# EAGLE design current_sense (EAGLE 6.5.0)
AUTHOR: Brad Campbell; REV: v3; TITLE: Current Sense
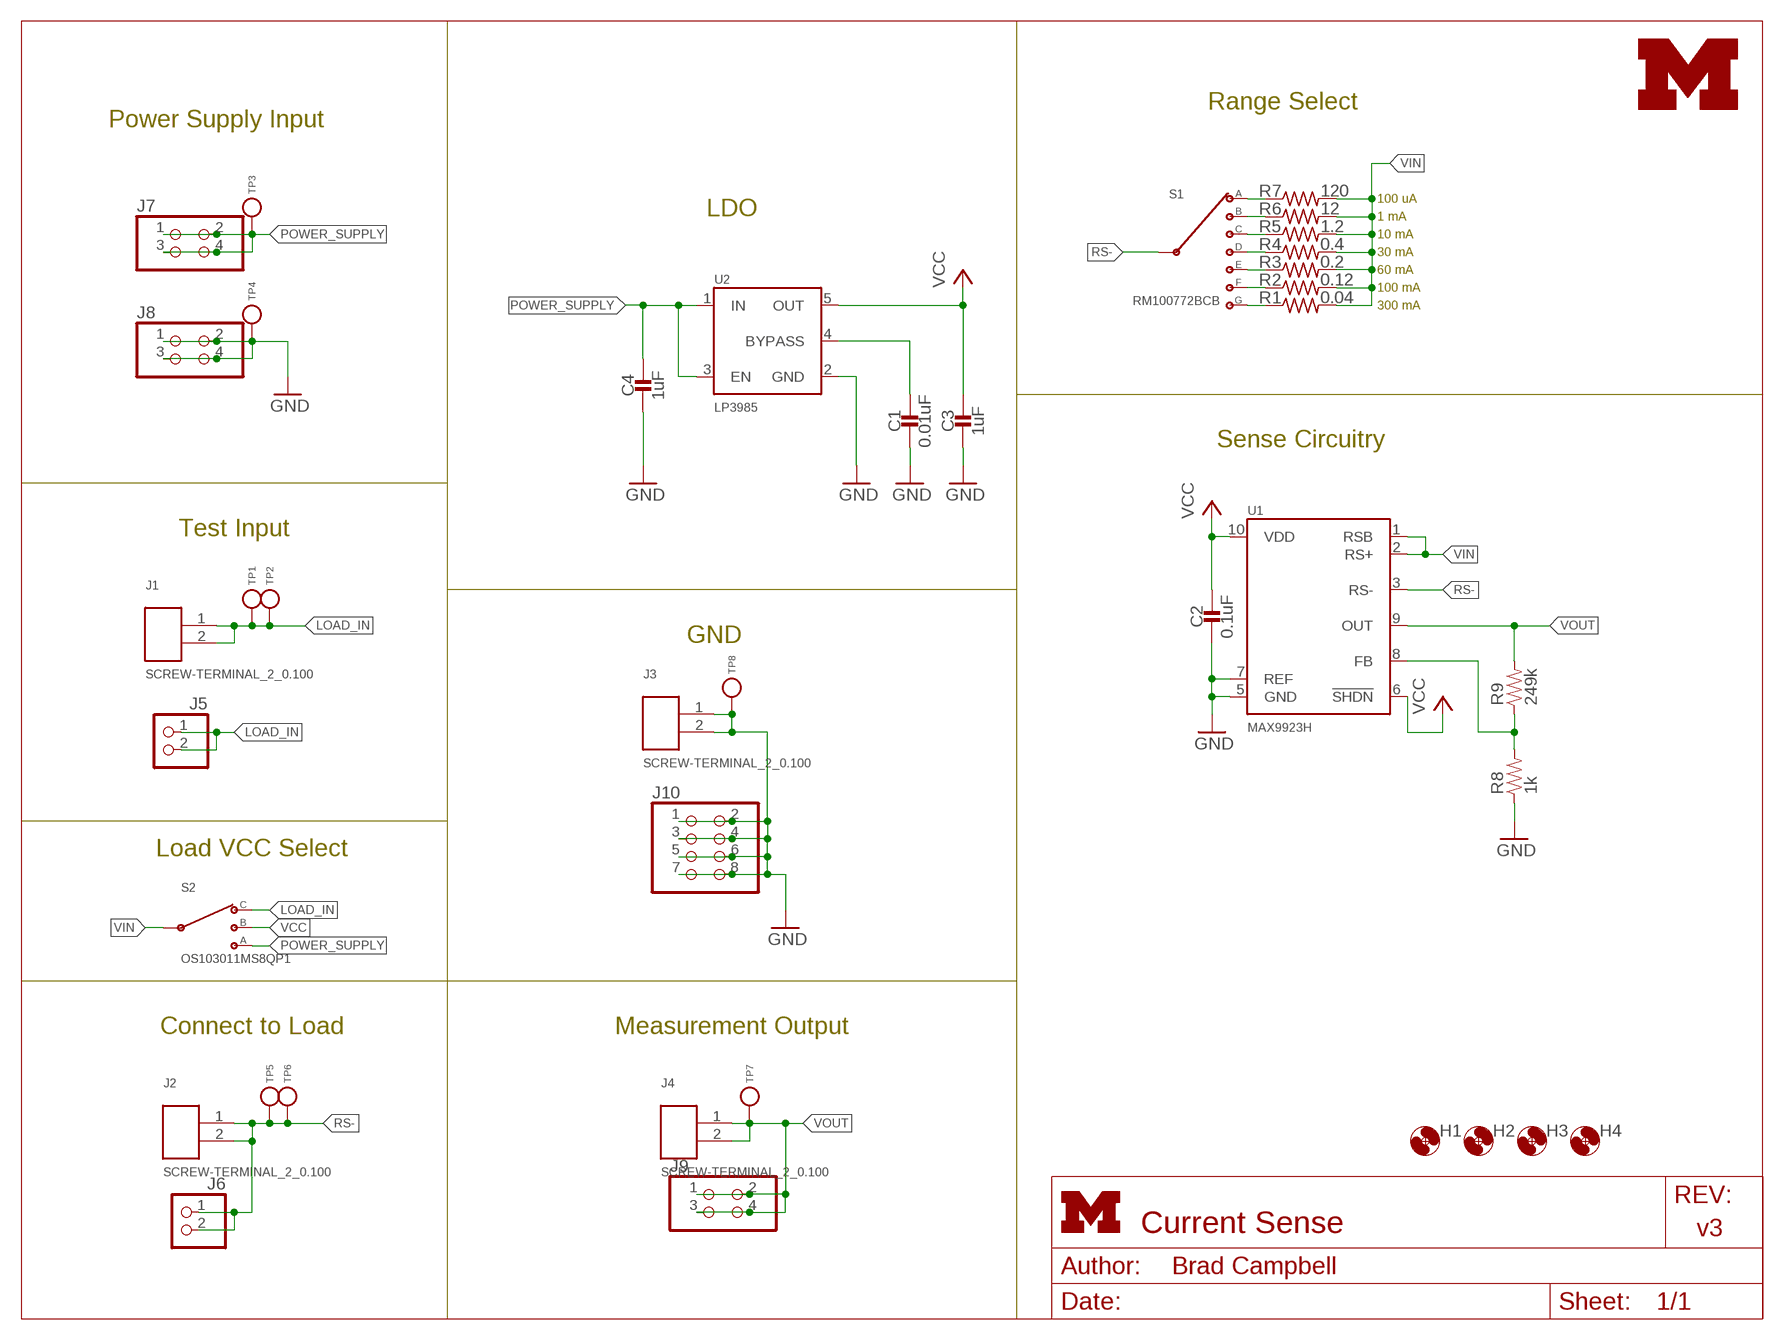
[diagram p0: schematic, sheet 1]
FRAME1 (LETTER_L_UMICH): HEIGHT: 8.5in; WIDTH: 11in

## Parts
C1  0.01uF  CAPACITOR0603_CAP  [0603_CAP]
C2  0.1uF  CAPACITOR0603_CAP  [0603_CAP]
C3  1uF  CAPACITOR0603_CAP  [0603_CAP]
C4  1uF  CAPACITOR0603_CAP  [0603_CAP]
H1  MOUNT-HOLE3.2  [3,2]
H2  MOUNT-HOLE3.2  [3,2]
H3  MOUNT-HOLE3.2  [3,2]
H4  MOUNT-HOLE3.2  [3,2]
J1  SCREW-TERMINAL_2_0.100  [CONN_BLOCK_2]
J2  SCREW-TERMINAL_2_0.100  [CONN_BLOCK_2]
J3  SCREW-TERMINAL_2_0.100  [CONN_BLOCK_2]
J4  SCREW-TERMINAL_2_0.100  [CONN_BLOCK_2]
J5  PINHD-1X2  [1X02]
J6  PINHD-1X2  [1X02]
J7  PINHD-2X2  [2X02]
J8  PINHD-2X2  [2X02]
J9  PINHD-2X2  [2X02]
J10  PINHD-2X4  [2X04]
LOGO2  UMICH_SOLID_MEDIUM  [UMICH_SOLID_200MIL]
R1  0.04  R-US_R1206  [R1206]
R2  0.12  R-US_R1206  [R1206]
R3  0.2  R-US_R1206  [R1206]
R4  0.4  R-US_R1206  [R1206]
R5  1.2  R-US_R0805  [R0805]
R6  12  R-US_R0805  [R0805]
R7  120  R-US_R0805  [R0805]
R8  1k  RESISTOR0603_RES  [0603-RES]
R9  249k  RESISTOR0603_RES  [0603-RES]
S1  RM100772BCB  [RM-SWITCH]
S2  OS103011MS8QP1  [OS102011MS8QP1]
TP1  TEST_POINT_0.040IN  [TESTPOINT_0.040IN]
TP2  TEST_POINT_0.040IN  [TESTPOINT_0.040IN]
TP3  TEST_POINT_0.040IN  [TESTPOINT_0.040IN]
TP4  TEST_POINT_0.040IN  [TESTPOINT_0.040IN]
TP5  TEST_POINT_0.040IN  [TESTPOINT_0.040IN]
TP6  TEST_POINT_0.040IN  [TESTPOINT_0.040IN]
TP7  TEST_POINT_0.040IN  [TESTPOINT_0.040IN]
TP8  TEST_POINT_0.112IN  [TESTPOINT_0.112IN]
U1  MAX9923H  [UMAX10]
U2  LP3985  [R-PDSO-G5]

## Nets
GND: C1.2 C2.2 C3.2 C4.2 J3.1 J3.2 J8.1 J8.2 J8.3 J8.4 J10.1 J10.2 J10.3 J10.4 J10.5 J10.6 J10.7 J10.8 R8.1 TP4.TESTPOINT TP8.1(TESTPOINT) U1.5(GND) U1.7(REF) U2.2(GND)
LOAD_IN: J1.1 J1.2 J5.1 J5.2 S2.4 TP1.TESTPOINT TP2.TESTPOINT
N$1: R7.1 S1.1(A)
N$2: R6.1 S1.2(B)
N$3: R5.1 S1.3(C)
N$4: R4.1 S1.4(D)
N$5: R3.1 S1.5(E)
N$6: R2.1 S1.6(F)
N$7: R8.2 R9.1 U1.8(FB)
N$8: C1.1 U2.4(BYPASS)
N$9: R1.1 S1.7(G)
POWER_SUPPLY: C4.1 J7.1 J7.2 J7.3 J7.4 S2.1 TP3.TESTPOINT U2.1(IN) U2.3(EN)
RS-: J2.1 J2.2 J6.1 J6.2 S1.C(INPUT) TP5.TESTPOINT TP6.TESTPOINT U1.3(RS-)
VCC: C2.1 C3.1 S2.3 U1.6(!SHDN) U1.10(VDD) U2.5(OUT)
VIN: R1.2 R2.2 R3.2 R4.2 R5.2 R6.2 R7.2 S2.2(C) U1.1(RSB) U1.2(RS+)
VOUT: J4.1 J4.2 J9.1 J9.2 J9.3 J9.4 R9.2 TP7.TESTPOINT U1.9(OUT)

## Notes on the sheet
- Range Select
- Power Supply Input
- 100 uA
- LDO | 1 mA
- 10 mA
- 30 mA
- 60 mA
- 100 mA
- 300 mA
- Sense Circuitry
- Test Input
- GND
- Load VCC Select
- Connect to Load | Measurement Output

## Library data of the parts
C1 = passives:CAPACITOR: 0402 Capacitor; DIGIKEY: 445-5100-1-ND
C2 = passives:CAPACITOR: 0402 Capacitor; DIGIKEY: 445-1316-1-ND
C3 C4 = passives:CAPACITOR: 0402 Capacitor; DIGIKEY: 445-1604-1-ND
H1-H4 = holes:MOUNT-HOLE: MOUNTING HOLE with drill center marker
J1-J4 = headers:SCREW-TERMINAL_2_0.100: 2x 0.100 in screw terminal block; DIGIKEY: 277-1273-ND; MOUSER: 651-1725656; NEWARK: 71C4107
J5 J6 = pinhead:PINHD-1X2: PIN HEADER
J7-J9 = pinhead:PINHD-2X2: PIN HEADER
J10 = pinhead:PINHD-2X4: PIN HEADER
LOGO2 = logos:UMICH_SOLID
R1 = resistor:R-US_: RESISTOR, American symbol; DIGIKEY: 311-.04LWCT-ND
R2 = resistor:R-US_: RESISTOR, American symbol; DIGIKEY: RL16R.12FCT-ND
R3 = resistor:R-US_: RESISTOR, American symbol; DIGIKEY: CSR1206FKR200CT-ND
R4 = resistor:R-US_: RESISTOR, American symbol; DIGIKEY: 311-.4LWCT-ND
R5 = resistor:R-US_: RESISTOR, American symbol; DIGIKEY: RL12S1.2FCT-ND
R6 = resistor:R-US_: RESISTOR, American symbol; DIGIKEY: A103150CT-ND
R7 = resistor:R-US_: RESISTOR, American symbol; DIGIKEY: RG20N120WCT-ND
R8 = passives:RESISTOR: Resistor Basic schematic elements and footprints for 0603, 1206, and PTH resistors.; DIGIKEY: P1.0KDBCT-ND
R9 = passives:RESISTOR: Resistor Basic schematic elements and footprints for 0603, 1206, and PTH resistors.; DIGIKEY: P249KDBCT-ND
S1 = switches:RM100772BCB: Rotary Switch 8 Position SP7T 500mA (DC) 24VDC Through Hole; DIGIKEY: CKN10705-ND
S2 = switches:OS103011MS8QP1: Slide Switch SP3T Through Hole; DIGIKEY: CKN9543-ND
TP1-TP7 = headers:TEST_POINT_0.040IN: 0.040in Test Point; DIGIKEY: 5001K-ND
TP8 = headers:TEST_POINT_0.112IN: Solder terminal, turreted; NEWARK: 40F6015
U1 = chips:MAX992: The MAX9922/MAX9923 ultra-precision, high-side current- sense amplifiers feature ultra-low offset voltage (VOS) of 25μV (max) and laser-trimmed gain accuracy better than 0.5%. The combination of low VOS and highgain accuracy allows precise current measurements even at very small sense voltages.; DIGIKEY: MAX9922EUB+TCT-ND
U2 = chips:LP3985: Linear Voltage Regulator IC Positive Fixed 1 Output 3.3V 150mA SOT-23-5; DIGIKEY: LP3985IM5-3.3/NOPBCT-ND

## Board
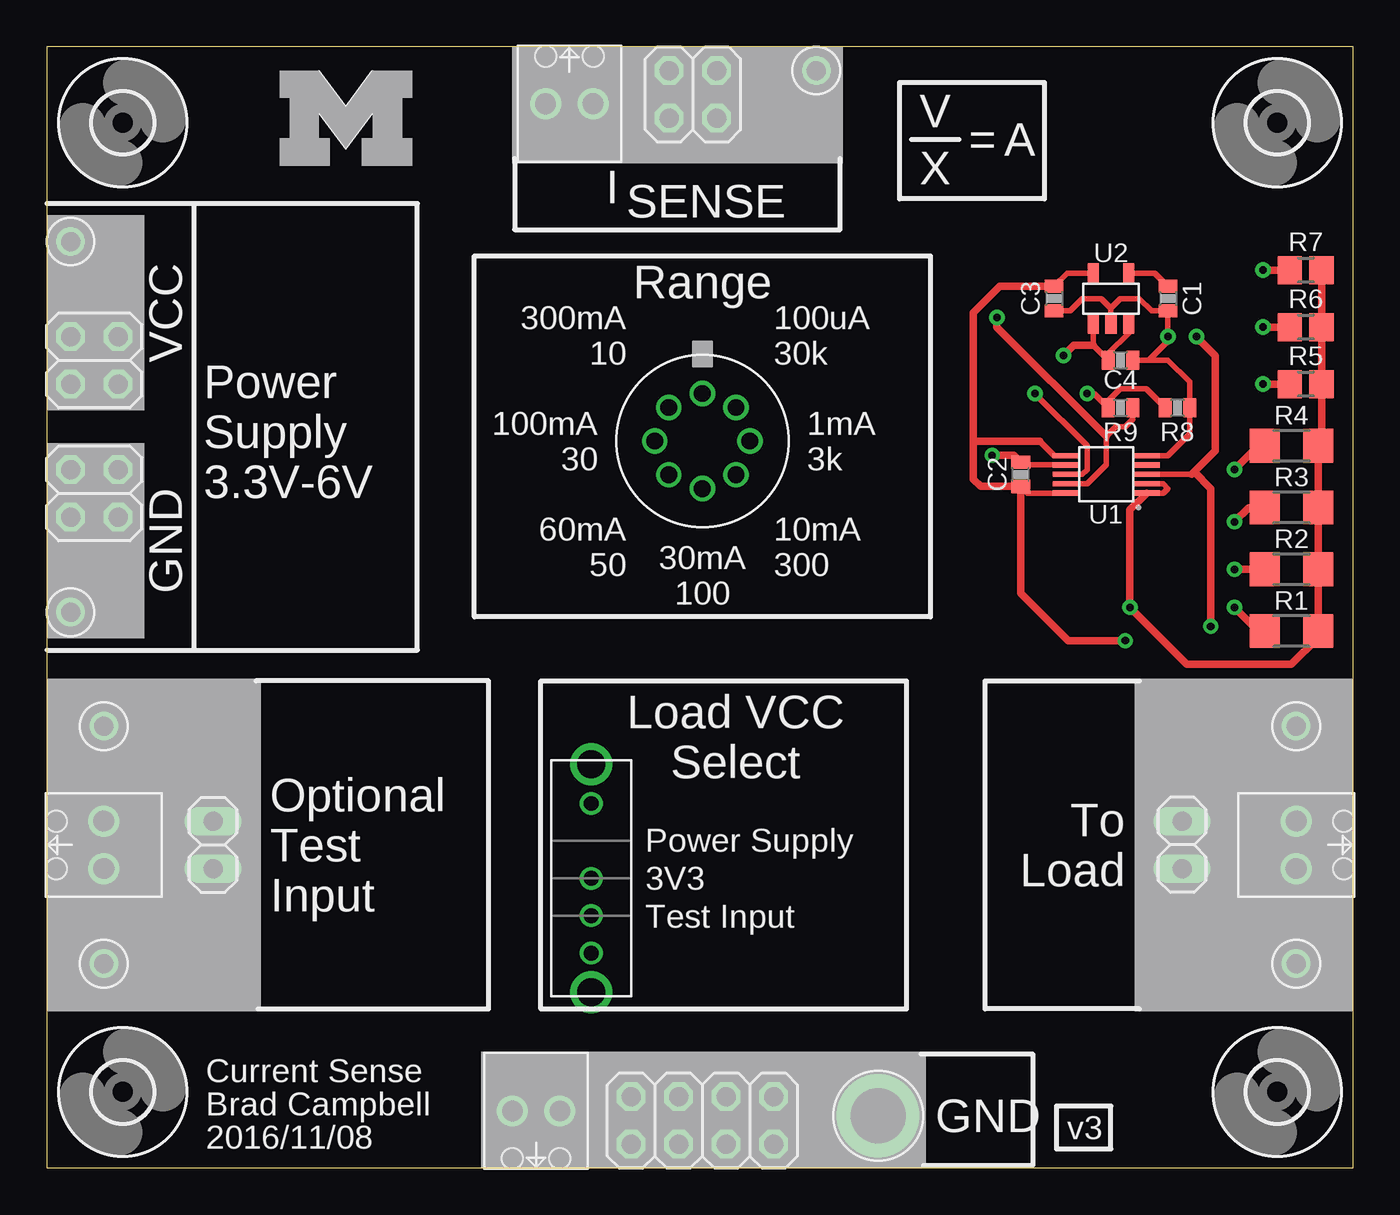
[diagram p1: board, top side]
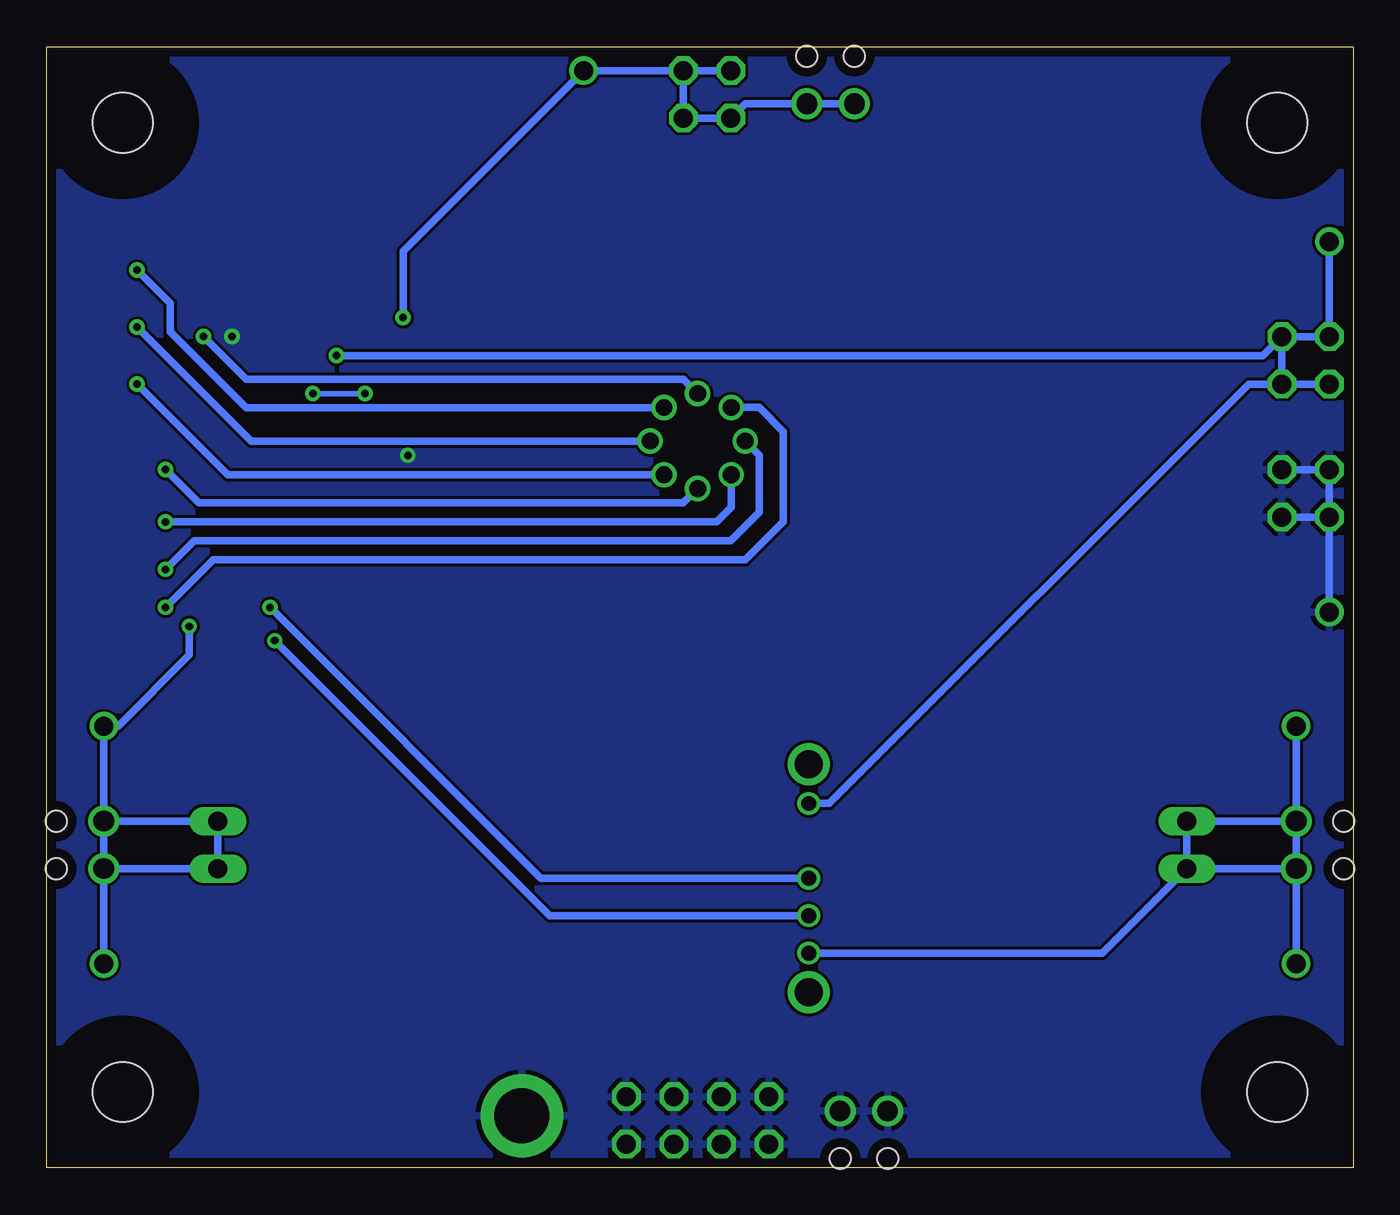
[diagram p2: board, bottom side, seen from below]

Size 69.85 x 59.94 mm. Coordinates in mm from the lower left corner, seen from the top.
Outline: 0,0 69.85,0 69.85,59.94 0,59.94 0,0
Copper layers (1*16): Top 0.0178mm / dielectric 59mil / Bottom 0.0178mm
Design rules "sunstone-2lyr_v1.0.0.3": minimum track width 6mil, minimum drill 14mil, track to track 6mil, track to pad 6mil, pad to pad 6mil, via to via 6mil, smd to smd 6mil, copper to edge 20mil, drill to drill 16mil, minimum pad ring 8mil, minimum via ring 8mil, stop-mask expansion 3mil, vias tented up to drill 50mil, thermal gap 10mil

### Footprints (pad centres in the part's own frame; a part is rotated, then mirrored left to right if it is on the bottom)
0603_CAP = smd 0.7 x 1: 1 -0.65,0; 2 0.65,0
3,2 = hole 3.2: 0,0
CONN_BLOCK_2 = drill 1.1: 1 -1.27,0; 2 1.27,0 | hole 1.12: -1.27,-2.54; 1.27,-2.54
1X02 = drill 1.016 long: 1 -1.27,0; 2 1.27,0
2X02 = drill 1.016 octagon: 1 -1.27,-1.27; 2 -1.27,1.27; 3 1.27,-1.27; 4 1.27,1.27
2X04 = drill 1.016 octagon: 1 -3.81,-1.27; 2 -3.81,1.27; 3 -1.27,-1.27; 4 -1.27,1.27; 5 1.27,-1.27; 6 1.27,1.27; 7 3.81,-1.27; 8 3.81,1.27
R1206 = smd 1.6 x 1.803: 1 -1.422,0; 2 1.422,0
R0805 = smd 1.3 x 1.5: 1 -0.85,0; 2 0.85,0
0603-RES = smd 0.7 x 1: 1 -0.65,0; 2 0.65,0
RM-SWITCH = drill 0.9: 1 1.796,1.796; 2 2.54,0; 3 1.796,-1.796; 4 0,-2.54; 5 -1.796,-1.796; 6 -2.54,0; 7 -1.796,1.796; C 0,2.54
OS102011MS8QP1 = drill 0.8: 1 -4,0; 2 0,0; 3 2,0; 4 4,0 | drill 1.5: MOUNT1 -6.1,0; MOUNT2 6.1,0
TESTPOINT_0.040IN = drill 1.016: TESTPOINT 0,0
TESTPOINT_0.112IN = drill 2.946: 1 0,0
UMAX10 = smd 0.28 x 1.4: 1 -1,-2.17; 2 -0.5,-2.17; 3 0,-2.17; 4 0.5,-2.17; 5 1,-2.17; 6 1,2.17; 7 0.5,2.17; 8 0,2.17; 9 -0.5,2.17; 10 -1,2.17
R-PDSO-G5 = smd 0.6 x 1.05: 1 -0.95,-1.35; 2 0,-1.35; 3 0.95,-1.35; 4 0.95,1.35; 5 -0.95,1.35

### Placement (x,y rotation side)
C1  59.94,46.48 270 top
C2  52.07,37.08 90 top
C3  53.85,46.48 270 top
C4  57.4,43.18 0 top
H1  4.06,4.06 0 top
H2  65.79,4.06 0 top
H3  65.79,55.88 0 top
H4  4.06,55.88 0 top
J1  3.05,17.27 270 top
J2  66.8,17.27 90 top
J3  26.16,3.05 0 top
J4  27.94,56.9 180 top
J5  8.89,17.27 90 top
J6  60.71,17.27 270 top
J7  2.54,43.18 90 top
J8  2.54,36.07 90 top
J9  34.54,57.4 0 top
J10  35.05,2.54 0 top
LOGO2  12.45,53.59 0 top
R1  66.55,28.7 0 top
R2  66.55,32 0 top
R3  66.55,35.31 0 top
R4  66.55,38.61 0 top
R5  67.31,41.91 0 top
R6  67.31,44.96 0 top
R7  67.31,48.01 0 top
R8  60.45,40.64 180 top
R9  57.4,40.64 0 top
S1  35.05,38.86 0 top
S2  29.11,15.49 270 top
TP1  3.05,10.92 0 top
TP2  3.05,23.62 0 top
TP3  1.27,49.53 90 top
TP4  1.27,29.72 90 top
TP5  66.8,23.62 180 top
TP6  66.8,10.92 180 top
TP7  41.15,58.67 0 top
TP8  44.45,2.79 0 top
U1  56.64,37.08 90 top
U2  56.9,46.48 0 top

### Tracks (layer width: path | path; a pad name or v marks a point on that pad's centre or on a via)
GND  (via drill 0.41)
  Top 0.305: U1.5 59.93,38.08 61.1,39.26 R8.1 61.1,42.02 59.94,43.18 58.93,43.18 | U1.7 52.22,37.58 C2.2 | 56.9,45.97 57.4,46.48 58.42,46.48 59.07,45.83 C1.2 v59.94,44.45 59.94,44.2 58.93,43.18 | 56.9,45.97 U2.2 | C3.2 54.72,45.83 55.37,46.48 56.39,46.48 56.9,45.97 | C4.2 58.93,43.18
  Top 0.406: 52.22,37.58 51.7,38.1 v50.55,38.1
  Bottom 0.406: J8.3 J8.4 J8.2 | J8.2 J8.1 | J8.2 TP4.TESTPOINT
  pour Bottom: -2.54,63.5 73.66,63.5 73.66,-2.54 -2.54,-2.54
LOAD_IN
  Bottom 0.406: TP1.TESTPOINT J1.2 | J1.1 J1.2 | TP2.TESTPOINT J1.1 | J1.1 J5.2 J5.1 | J5.1 J1.2 | S2.4 13.41,11.49 J5.1
N$1  (via drill 0.41)
  Top 0.406: v65.02,48.01 R7.1
  Bottom 0.406: v65.02,48.01 63.25,46.23 63.25,44.7 59.18,40.64 36.87,40.64 S1.1
N$2  (via drill 0.41)
  Top 0.406: v65.02,44.96 R6.1
  Bottom 0.406: v65.02,44.96 58.93,38.86 S1.2
N$3  (via drill 0.41)
  Top 0.406: v65.02,41.91 R5.1
  Bottom 0.406: v65.02,41.91 60.18,37.07 S1.3
N$4  (via drill 0.41)
  Top 0.406: R4.1 64.77,38.61 v63.5,37.34
  Bottom 0.406: S1.4 35.81,35.56 61.72,35.56 v63.5,37.34
N$5  (via drill 0.41)
  Top 0.406: R3.1 64.26,35.31 v63.5,34.54
  Bottom 0.406: v63.5,34.54 34.04,34.54 33.26,35.32 S1.5
N$6  (via drill 0.41)
  Top 0.406: v63.5,32 R2.1
  Bottom 0.406: S1.6 31.75,38.1 31.75,35.05 33.27,33.53 61.98,33.53 v63.5,32
N$7  (via drill 0.41)
  Top 0.305: R8.2 58.79,41.66 57.4,41.66 56.75,41.01 R9.1 55.99,41.4 v55.63,41.4 | v52.83,41.4 55.63,38.61 55.63,37.34 55.37,37.08 U1.8
  Bottom 0.305: v55.63,41.4 v52.83,41.4
N$8
  Top 0.305: C1.1 59.24,47.83 U2.4
N$9  (via drill 0.41)
  Top 0.406: v63.5,29.97 64.77,28.7 R1.1
  Bottom 0.406: S1.7 31.77,40.66 30.48,39.37 30.48,34.54 32.51,32.51 60.96,32.51 v63.5,29.97
POWER_SUPPLY  (via drill 0.41)
  Top 0.305: U2.1 55.95,43.99 C4.1 56.75,43.55 57.85,44.64 U2.3
  Top 0.406: 55.95,43.99 54.91,43.99 v54.36,43.43
  Bottom 0.406: TP3.TESTPOINT J7.4 J7.3 | J7.3 J7.1 | J7.2 J7.1 | S2.1 28.01,19.49 5.59,41.91 J7.1 | v54.36,43.43 4.83,43.43 J7.3
RS-  (via drill 0.41)
  Top 0.305: 61.21,37.08 U1.3
  Top 0.406: 61.34,37.21 62.48,38.35 62.48,43.43 v61.47,44.45 | 61.34,37.21 61.21,37.08 | v62.23,28.96 62.23,36.32 61.34,37.21
  Bottom 0.406: J2.2 TP5.TESTPOINT 66.04,23.62 62.23,27.43 v62.23,28.96 | J2.1 J2.2 | TP6.TESTPOINT J2.1 | J2.2 J6.1 J6.2 J2.1 | v61.47,44.45 59.18,42.16 35.81,42.16 S1.C
VCC  (via drill 0.41)
  Top 0.305: U1.10 52.42,36.08 C2.1 | C3.1 54.55,47.83 U2.5 | U1.6 53.86,38.08 53.09,38.86
  Top 0.406: v57.66,28.19 54.61,28.19 52.07,30.73 C2.1 49.93,36.43 49.53,36.83 49.53,38.86 | 53.09,38.86 49.53,38.86 | C3.1 50.94,47.13 49.53,45.72 49.53,38.86
  Bottom 0.406: S2.3 42.95,13.49 v57.66,28.19
VIN  (via drill 0.41)
  Top 0.305: U1.2 59.69,36.58 59.94,36.32 59.69,36.07 59.67,36.08 U1.1
  Top 0.406: R7.2 R6.2 R5.2 68.16,38.8 R4.2 R3.2 R2.2 R1.2 67.97,28.35 66.55,26.92 60.96,26.92 v57.91,29.97 57.91,35.18 U1.1
  Bottom 0.406: S2.2 43.43,15.49 v57.91,29.97
VOUT  (via drill 0.41)
  Top 0.305: U1.9 55.63,36.58 56.64,37.59 56.64,39.12 57.15,39.62 57.66,39.62 58.05,40.02 R9.2
  Top 0.406: v50.8,45.47 50.8,44.96 56.64,39.12
  Bottom 0.406: J4.2 J4.1 32.51,56.9 J9.1 J9.3 J9.4 | J9.2 J9.4 | J9.4 TP7.TESTPOINT 50.8,49.02 v50.8,45.47

### Text on the board
tPlace: V | = | A | X | I | SENSE | VCC | Range | 300mA / 10 | 100uA / 30k | Power / Supply / 3.3V-6V | 100mA / 30 | 1mA / 3k | 60mA / 50 | 10mA / 300 | GND | 30mA / 100 | Load VCC / Select | Power Supply | Optional / Test / Input | To / Load | 3V3 | Test Input | Current Sense | Brad Campbell | GND | v3 | 2016/11/08